# EAGLE schematic led_smd (EAGLE 9.2.2)
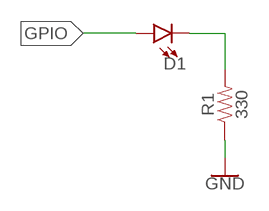
[diagram p0: schematic, sheet 1]

## Parts
D1  LED1206  [LED-1206]
R1  330  RESISTOR1206  [1206]

## Nets
GND: R1.1
GPIO: D1.A
N$1: D1.C R1.2

## Library data of the parts
D1 = SparkFun-LED:LED: LED (Generic) Standard schematic elements and footprints for 5mm, 3mm, 1206, and 0603 sized LEDs. Generic LEDs with no color specified.
R1 = SparkFun-Resistors:RESISTOR: Generic Resistor Package